# Altium schematic sheet Volant5.ROTARY_SW_v1.0.SchDoc
size A
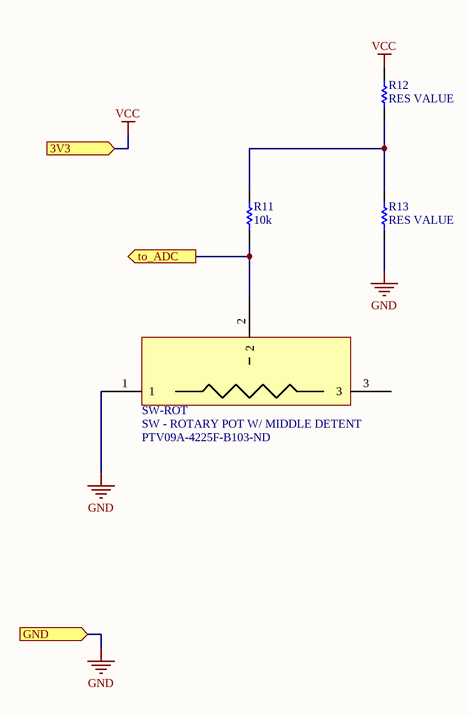
[diagram p0: Volant5.ROTARY_SW_v1.0.SchDoc]

## Parts
R11  value 10k  [RS-0603]  (hidden comment: RS - RESISTOR)
R12  value RES VALUE  [RS-0603]  (hidden comment: RS - RESISTOR)
R13  value RES VALUE  [RS-0603]  (hidden comment: RS - RESISTOR)
SW-ROT  SW - ROTARY POT W/ MIDDLE DETENT  Supplier Part Number 1: PTV09A-4225F-B103-ND  [SW - ROTARY POT W/ DETENT]

## Ports
3V3 (in), GND (in), to_ADC (out)

## Nets
GND: R13.1 SW-ROT.1 ; port GND
VCC: R12.2 ; port 3V3
to_ADC: R11.1 SW-ROT.2 ; port to_ADC
NetR11_2: R11.2 R12.1 R13.2

Not connected (* = marked no-connect by the designer): SW-ROT 3

## Library data of the parts
R11-R13 = RS - RESISTOR: TOLERANCE: RES TOL; POWER: RES POWER; Supplier Part Number 1: *; Supplier 1: *; (FIELD A): *; (FLIED C): *; (FIELD B): *; Manufacturer: *
SW-ROT = SW - ROTARY POT W/ MIDDLE DETENT: Potentiomètre rotatif +-140 deg avec détente au milieu; KNOB: 226-4105-ND; Supplier 1: Digi-Key